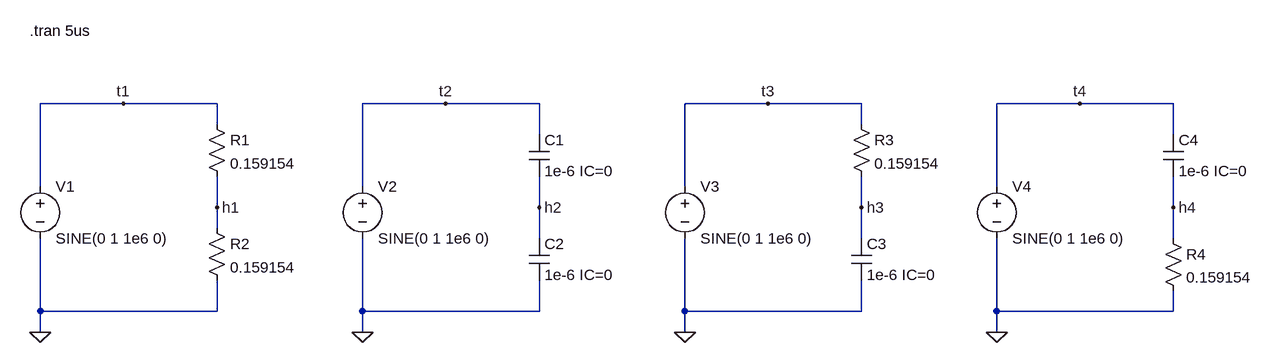
[diagram p0: schematic impedance_and_phase.asc]
impedance_and_phase.asc, the LTspice schematic file:
Version 4.1
SHEET 1 2052 708
WIRE -352 -16 -480 -16
WIRE -208 -16 -352 -16
WIRE 144 -16 16 -16
WIRE 288 -16 144 -16
WIRE 640 -16 512 -16
WIRE 784 -16 640 -16
WIRE 1120 -16 992 -16
WIRE 1264 -16 1120 -16
WIRE -208 16 -208 -16
WIRE 784 16 784 -16
WIRE 288 32 288 -16
WIRE 1264 32 1264 -16
WIRE -480 112 -480 -16
WIRE 16 112 16 -16
WIRE 512 112 512 -16
WIRE 992 112 992 -16
WIRE -208 144 -208 96
WIRE 288 144 288 96
WIRE 784 144 784 96
WIRE 1264 144 1264 96
WIRE -208 176 -208 144
WIRE 288 192 288 144
WIRE 784 192 784 144
WIRE 1264 192 1264 144
WIRE -480 304 -480 192
WIRE -208 304 -208 256
WIRE -208 304 -480 304
WIRE 16 304 16 192
WIRE 288 304 288 256
WIRE 288 304 16 304
WIRE 512 304 512 192
WIRE 784 304 784 256
WIRE 784 304 512 304
WIRE 992 304 992 192
WIRE 1264 304 1264 272
WIRE 1264 304 992 304
WIRE -480 336 -480 304
WIRE 16 336 16 304
WIRE 512 336 512 304
WIRE 992 336 992 304
FLAG -480 336 0
FLAG 512 336 0
FLAG 16 336 0
FLAG 144 -16 t2
FLAG 640 -16 t3
FLAG -352 -16 t1
FLAG 288 144 h2
FLAG 784 144 h3
FLAG -208 144 h1
FLAG 992 336 0
FLAG 1120 -16 t4
FLAG 1264 144 h4
SYMBOL voltage -480 96 R0
WINDOW 123 0 0 Left 0
WINDOW 39 0 0 Left 0
SYMATTR InstName V1
SYMATTR Value SINE(0 1 1e6 0)
SYMBOL res -224 0 R0
SYMATTR InstName R1
SYMATTR Value 0.159154
SYMBOL res -224 160 R0
SYMATTR InstName R2
SYMATTR Value 0.159154
SYMBOL voltage 512 96 R0
WINDOW 123 0 0 Left 0
WINDOW 39 0 0 Left 0
SYMATTR InstName V3
SYMATTR Value SINE(0 1 1e6 0)
SYMBOL res 768 0 R0
SYMATTR InstName R3
SYMATTR Value 0.159154
SYMBOL cap 768 192 R0
SYMATTR InstName C3
SYMATTR Value 1e-6 IC=0
SYMBOL voltage 16 96 R0
WINDOW 123 0 0 Left 0
WINDOW 39 0 0 Left 0
SYMATTR InstName V2
SYMATTR Value SINE(0 1 1e6 0)
SYMBOL cap 272 192 R0
SYMATTR InstName C2
SYMATTR Value 1e-6 IC=0
SYMBOL cap 272 32 R0
SYMATTR InstName C1
SYMATTR Value 1e-6 IC=0
SYMBOL voltage 992 96 R0
WINDOW 123 0 0 Left 0
WINDOW 39 0 0 Left 0
SYMATTR InstName V4
SYMATTR Value SINE(0 1 1e6 0)
SYMBOL res 1248 176 R0
SYMATTR InstName R4
SYMATTR Value 0.159154
SYMBOL cap 1248 32 R0
SYMATTR InstName C4
SYMATTR Value 1e-6 IC=0
TEXT -496 -128 Left 2 !.tran 5us

The netlist it stands for:
* impedance_and_phase.asc
V1 t1 0 SINE(0 1 1e6 0)
R1 t1 h1 0.159154
R2 h1 0 0.159154
V3 t3 0 SINE(0 1 1e6 0)
R3 t3 h3 0.159154
C3 h3 0 1e-6 IC=0
V2 t2 0 SINE(0 1 1e6 0)
C2 h2 0 1e-6 IC=0
C1 t2 h2 1e-6 IC=0
V4 t4 0 SINE(0 1 1e6 0)
R4 h4 0 0.159154
C4 t4 h4 1e-6 IC=0
.tran 5us
.backanno
.end